# EAGLE design MaPIE RP2040 0.96‘‘ OLED V1.1 (EAGLE 6.1)
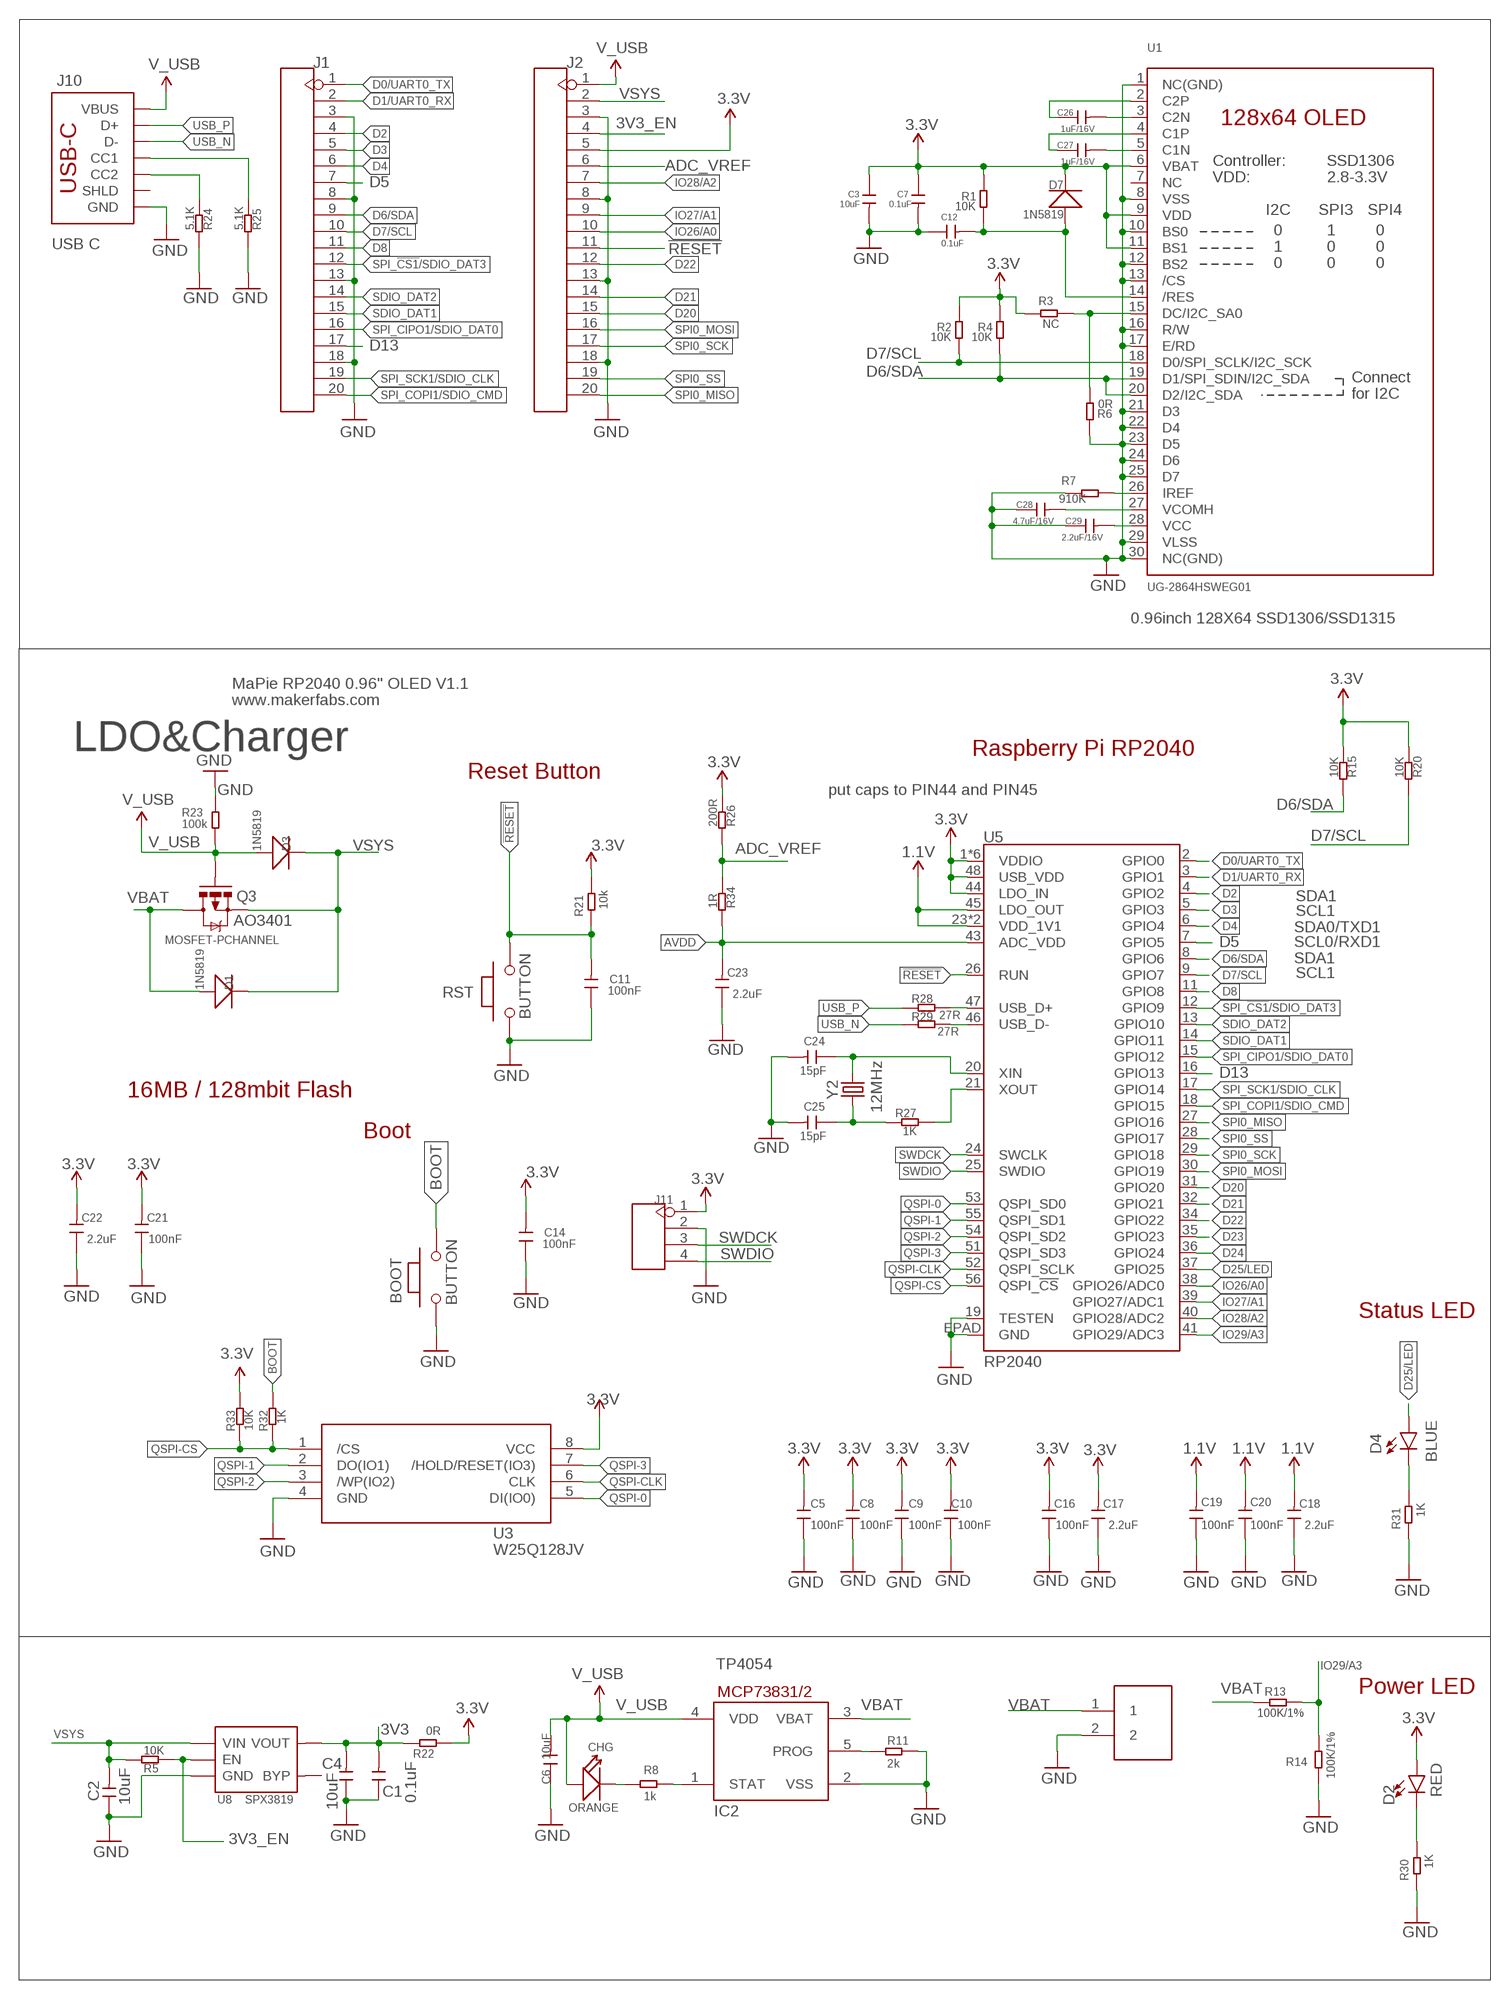
[diagram p0: schematic, sheet 1]

## Parts
BAT  PH2.0-2P-90-DIP  [PH2.0-2P-90-DIP]
BOOT  BUTTON  PB157  [157SW]
C1  0.1uF  C-0603  [C0603]
C2  10uF  C-0603  [C0603]
C3  10uF  C-0603  [C0603]
C4  10uF  C-0603  [C0603]
C5  100nF  C-0603  [C0603]
C6  10uF  C-0603  [C0603]
C7  0.1uF  C-0603  [C0603]
C8  100nF  C-0603  [C0603]
C9  100nF  C-0603  [C0603]
C10  100nF  C-0603  [C0603]
C11  100nF  C-0603  [C0603]
C12  0.1uF  C-0603  [C0603]
C14  100nF  C-0603  [C0603]
C16  100nF  C-0603  [C0603]
C17  2.2uF  C-0603  [C0603]
C18  2.2uF  C-0603  [C0603]
C19  100nF  C-0603  [C0603]
C20  100nF  C-0603  [C0603]
C21  100nF  C-0603  [C0603]
C22  2.2uF  C-0603  [C0603]
C23  2.2uF  C-0603  [C0603]
C24  15pF  C-0603  [C0603]
C25  15pF  C-0603  [C0603]
C26  1uF/16V  C-0603  [C0603]
C27  1uF/16V  C-0603  [C0603]
C28  4.7uF/16V  C-0603  [C0603]
C29  2.2uF/16V  C-0603  [C0603]
CHG  ORANGE  007-LED0603  [D0603]
D1  1N5819  D'0805'  [SOD323]
D2  RED  LED-RED0603  [LED-0603]
D3  1N5819  D'0805'  [SOD323]
D4  BLUE  LED-BLUE0603  [LED-0603]
D7  1N5819  D'0805'  [SOD323]
IC2  MCP73831/OT  [SOT23-5L]
J1  HEADER-20P-2.54  [20P-2.54]
J2  HEADER-20P-2.54  [20P-2.54]
J10  USB C  USB_C_4-LAYER-ISOLATED  [USB-C-16P-4LAYER-ISOLATED]
J11  HEADER-4P-60/35MILROUND  [4P-65/35ROUND]
Q3  MOSFET-PCHANNEL  [SOT23-3]
R1  10K  R-0603  [0603]
R2  10K  R-0603  [0603]
R3  NC  R-0603  [0603]
R4  10K  R-0603  [0603]
R5  10K  R-0603  [0603]
R6  0R  R-0603  [0603]
R7  910K  R-0603  [0603]
R8  1k  R-0603  [0603]
R11  2k  R-0603  [0603]
R13  100K/1%  R-0603  [0603]
R14  100K/1%  R-0603  [0603]
R15  10K  R-0603  [0603]
R20  10K  R-0603  [0603]
R21  10k  R-0603  [0603]
R22  0R  R-0603  [0603]
R23  100k  R-0603  [0603]
R24  5.1K  R-0603  [0603]
R25  5.1K  R-0603  [0603]
R26  200R  R-0603  [0603]
R27  1K  R-0603  [0603]
R28  27R  R-0603  [0603]
R29  27R  R-0603  [0603]
R30  1K  R-0603  [0603]
R31  1K  R-0603  [0603]
R32  1K  R-0603  [0603]
R33  10K  R-0603  [0603]
R34  1R  R-0603  [0603]
RST  BUTTON  PB157  [157SW]
U1  UG-2864HSWEG01  DISP_OLED_UG-2864HSWEG010.96"  [UG-2864HSWEG01_0.96IN_WRAPAROUND]
U3  W25Q128JV  [SOIC-8-208MIL]
U5  RP2040  [QFN-56]
U8  SPX3819  [SOT23-5]
Y2  12MHz  CRYSTAL-12MHZ  [CRYSTAL-SMD-2X2.5MM]

## Nets
1.1V: C18.2 C19.2 C20.2 U5.23(VDD_1V1) U5.45(LDO_OUT) U5.50(VDD_1V1)
3.3V: C3.1 C5.2 C7.1 C8.2 C9.2 C10.2 C14.2 C16.2 C17.2 C21.2 C22.2 D2.A D7.- J2.5 J11.1 R1.2 R2.2 R3.2 R4.2 R15.2 R20.2 R21.1 R22.1 R26.2 R33.1 U1.6(VBAT) U1.9(VDD) U1.11(BS1) U3.8(VCC) U5.1(VDDIO) U5.10(VDDIO) U5.22(VDDIO) U5.33(VDDIO) U5.42(VDDIO) U5.44(LDO_IN) U5.48(USB_VDD) U5.49(VDDIO)
3V3: C1.2 C4.2 R22.2 U8.5(VOUT)
3V3_EN: J2.4 R5.2 U8.3(EN)
!RESET!: C11.2 J2.11 R21.2 RST.2 U5.26(RUN)
ADC_VREF: J2.6 R26.1 R34.2
AVDD: C23.2 R34.1 U5.43(ADC_VDD)
BOOT: BOOT.2 R32.1
D0/UART0_TX: J1.1 U5.2(GPIO0)
D1/UART0_RX: J1.2 U5.3(GPIO1)
D2: J1.4 U5.4(GPIO2)
D3: J1.5 U5.5(GPIO3)
D4: J1.6 U5.6(GPIO4)
D5: J1.7 U5.7(GPIO5)
D6/SDA: J1.9 R4.1 R15.1 U1.19(D1/SPI_SDIN/I2C_SDA) U1.20(D2/I2C_SDA) U5.8(GPIO6)
D7/SCL: J1.10 R2.1 R20.1 U1.18(D0/SPI_SCLK/I2C_SCK) U5.9(GPIO7)
D8: J1.11 U5.11(GPIO8)
D13: J1.17 U5.16(GPIO13)
D20: J2.15 U5.31(GPIO20)
D21: J2.14 U5.32(GPIO21)
D22: J2.12 U5.34(GPIO22)
D23: U5.35(GPIO23)
D24: U5.36(GPIO24)
D25/LED: D4.A U5.37(GPIO25)
GND: BAT.2 BOOT.1 C1.1 C2.1 C3.2 C4.1 C5.1 C6.1 C7.2 C8.1 C9.1 C10.1 C11.1 C12.1 C14.1 C16.1 C17.1 C18.1 C19.1 C20.1 C21.1 C22.1 C23.1 C24.2 C25.2 C28.1 C29.1 IC2.2(VSS) J1.3 J1.8 J1.13 J1.18 J2.3 J2.8 J2.13 J2.18 J10.GND J10.GND2(GND) J11.2 R6.2 R7.2 R11.2 R14.1 R23.2 R24.1 R25.1 R30.2 R31.2 RST.1 U1.1(NC(GND)) U1.8(VSS) U1.10(BS0) U1.12(BS2) U1.13(/CS) U1.16(R/W) U1.17(E/RD) U1.21(D3) U1.22(D4) U1.23(D5) U1.24(D6) U1.25(D7) U1.29(VLSS) U1.30(NC(GND)) U3.4(GND) U5.19(TESTEN) U5.EPAD(GND) U8.2(GND)
IO26/A0: J2.10 U5.38(GPIO26/ADC0)
IO27/A1: J2.9 U5.39(GPIO27/ADC1)
IO28/A2: J2.7 U5.40(GPIO28/ADC2)
IO29/A3: R13.1 R14.2 U5.41(GPIO29/ADC3)
N$1: C24.1 U5.20(XIN) Y2.P3
N$2: D4.C R31.1
N$3: R3.1 R6.1 U1.15(DC/I2C_SA0)
N$4: R27.1 U5.21(XOUT)
N$5: C28.2 U1.27(VCOMH)
N$6: C25.1 R27.2 Y2.P1
N$7: D2.C R30.1
N$8: C29.2 U1.28(VCC)
N$9: R7.1 U1.26(IREF)
N$10: C26.2 U1.3(C2N)
N$11: J10.A5(CC1) R25.2
N$12: J10.B5(CC2) R24.2
N$13: C26.1 U1.2(C2P)
N$14: C27.1 U1.4(C1P)
N$15: C27.2 U1.5(C1N)
N$20: C12.2 D7.+ R1.1 U1.14(/RES)
N$25: CHG.- R8.1
N$26: IC2.1(STAT) R8.2
N$31: IC2.5(PROG) R11.1
QSPI-0: U3.5(DI(IO0)) U5.53(QSPI_SD0)
QSPI-1: U3.2(DO(IO1)) U5.55(QSPI_SD1)
QSPI-2: U3.3(/WP(IO2)) U5.54(QSPI_SD2)
QSPI-3: U3.7(/HOLD/RESET(IO3)) U5.51(QSPI_SD3)
QSPI-CLK [Clock]: U3.6(CLK) U5.52(QSPI_SCLK)
QSPI-CS: R32.2 R33.2 U3.1(/CS) U5.56(QSPI_!CS!)
SDIO_DAT1: J1.15 U5.14(GPIO11)
SDIO_DAT2: J1.14 U5.13(GPIO10)
SPI0_MISO: J2.20 U5.27(GPIO16)
SPI0_MOSI: J2.16 U5.30(GPIO19)
SPI0_SCK: J2.17 U5.29(GPIO18)
SPI0_SS: J2.19 U5.28(GPIO17)
SPI_!CS1!/SDIO_DAT3: J1.12 U5.12(GPIO9)
SPI_CIPO1/SDIO_DAT0: J1.16 U5.15(GPIO12)
SPI_COPI1/SDIO_CMD: J1.20 U5.18(GPIO15)
SPI_SCK1/SDIO_CLK: J1.19 U5.17(GPIO14)
SWDCK: J11.3 U5.24(SWCLK)
SWDIO: J11.4 U5.25(SWDIO)
USB_F_N: R29.1 U5.46(USB_D-)
USB_F_P: R28.1 U5.47(USB_D+)
USB_N: J10.A7(D-) J10.B7(D-) R29.2
USB_P: J10.A6(D+) J10.B6(D+) R28.2
V_USB: C6.2 CHG.+ D3.+ IC2.4(VDD) J2.1 J10.VBUS1(VBUS) J10.VBUS2(VBUS) Q3.1(G) R23.1
VBAT: BAT.1 D1.+ IC2.3(VBAT) Q3.3(D) R13.2
VSYS: C2.2 D1.- D3.- J2.2 Q3.2(S) R5.1 U8.1(VIN)
Unconnected: J10.SHLD1(SHLD) J10.SHLD2(SHLD) J10.SHLD3(SHLD) J10.SHLD4(SHLD) J10.SHLD5(SHLD) J10.SHLD6(SHLD) J10.SHLD7(SHLD) J10.SHLD8(SHLD) U1.7(NC) U8.4(BYP)

## Notes on the sheet
- 0.96inch 128X64 SSD1306/SSD1315
- MaPie RP2040 0.96" OLED V1.1
- www.makerfabs.com
- LDO&Charger | Raspberry Pi RP2040
- Reset Button
- put caps to PIN44 and PIN45
- SDA1
- SCL1
- AO3401
- SDA0/TXD1
- SCL0/RXD1
- SDA1
- SCL1
- 16MB / 128mbit Flash
- Boot
- Status LED
- TP4054
- Power LED

## Library data of the parts
BAT = Connector:PH2.0-2P-90-DIP
BOOT RST = MySMD:PB157
C1-C12 C14 C16-C29 = Discrete:C*: Ceramic Capacitors
CHG = Discrete:007-LED*
D1 D3 D7 = Discrete:D*
D2 = SparkFun-LED:LED-RED: Red SMD LED Used in manufacturing of most products at SparkFun Packages: 0603 - SMD 0603 package [Product Link] <http://docs.avagotech.com/docs/AV02-0551EN> 0603 SMART - SMD 0603 SMART package ( more efficient and expensive)[Product Link] <http://www.osram-os.com/Graphics/XPic2/00077099_0.pdf> 1206 - SMD1206 package [Product Link] <https://www.sparkfun.com/datasheets/DevTools/LilyPad/Q150OVS4.pdff> SparkFun Products: Pro Mini 328 -5V <https://www.sparkfun.com/products/821> RedBoard <https://www.sparkfun.com/products/12757> IOIO-OTG <https://www.sparkfun.com/products/13613>; PROD_ID: DIO-00819
D4 = SparkFun-LED:LED-BLUE: Blue SMD LED Used in manufacturing of various products at SparkFun Packages: 0603 - SMD 0603 package [Product Link] <http://www.digikey.com/product-detail/en/SMLE12BC7TT86/511-1589-2-ND/1641808> 1206 - SMD1206 package [Product Link] <http://www.digikey.com/product-detail/en/lite-on-inc/LTST-C150TBKT/160-1643-1-ND/573584> SparkFun Products: ESP8266 Thing-Dev Board <https://www.sparkfun.com/products/13711> RedBoard <https://www.sparkfun.com/products/12757>; PROD_ID: DIO-08575
IC2 = adafruit:MCP73831: MCP73831/2 Miniature Single-Cell, Fully Integrated Li-Ion, Li-Polymer Charge Management Controllers. Nice and small simple lipoly charge controller, with adjustable current and status output (LED) http://www.ladyada.net/library/pcb/eaglelibrary.html
J1 J2 = Connector:HEADER-20P
J10 = SparkFun-Connectors:USB_C: USB Type C 16Pin Connector Super Speed pins not available on the 16-pin purely SMD connector so this part is best for USB 2.0 implementations. D1 and D2 are tied together enabling D+/- no matter which way the cable is plugged into the connector. The two channel configuration pins (CC1/2) are exposed. These are normally connected to ground via 5.1k resistors but can be reconfigured for high current/high power applications. **4-LAYER BOARD WARNING!!** If designing 4-layer board, make sure to select the variant _4-LAYER-ISOLATED. The linked footprint (USB-C-16-4LAYER-ISOLATED) includes some very necessary cutout polygons in the inner layers (2 and 15). This prevents the PTH mounting shield legs on the USB connector from electrically connecting any other polygons on the inner layers (usually VCC and GND).; PROD_ID: CONN-14122; VALUE: USB Female Type C Connector
J11 = Connector:HEADER-4P
Q3 = User-Submitted:MOSFET-PCHANNEL: Generic PMOSFET IRLML2244 - TRANS-11153 (SOT-23 -20V -4.3A) (1.Gate 2.Source 3.Drain) FQP27P06 - COM-10349 <http://www.sparkfun.com/products/10349> (TO-220 -60V -27A) (1.Gate 2.Source 3.Drain); PROD_ID: TRANS-08285
R1-R8 R11 R13-R15 R20-R34 = Discrete:R*
U1 = adafruit_display:DISP_OLED_UG-2864HSWEG01: UG-2864HSWEG01 OLED display Both 1.3" and 0.96" models share the same FPC tab footprint, only the screen dimensions vary.
U3 = self:W25Q128JV
U5 = RP2040:RP2040: Raspberry Pi RP2040 MCU 56-pin 32-bit Microcontroller with 264kB of SRAM and external flash support up to 16MB Getting Started with the RP2040 <https://pico.raspberrypi.org/getting-started/> Dual-core ARM Cortex M0+ processor, flexible clock running up to 133 MHz 264kB of SRAM, and QSPI control of common flash memory USB 1.1 Host and Device support Low-power sleep and dormant modes Drag & drop programming using mass storage over USB 26 multi-function GPIO pins 2×SPI, 2×I2C, 2×UART, 3×12-bit ADC, 16×controllable PWM channels Accurate clock and timer on-chip Temperature sensor Accelerated floating point libraries on-chip 8×Programmable IO (PIO) state machines for custom peripheral support; PROD_ID: IC-15502
U8 = IC:SPX3819
Y2 = SparkFun-Clocks:CRYSTAL-12MHZ: 12.0MHz Crystal Frequency: 12.0MHz Frequency Tolerance: ±20ppm Load Capacitance: 18pF SparkFun Products: SparkFun Logomatic <https://www.sparkfun.com/products/12772> Pocket AVR Programmer <https://www.sparkfun.com/products/9825>; PROD_ID: XTAL-15540

## Net classes
0 default: width 0.203 mm, drill 0.305 mm, clearance 0.152 mm
2 Clock: width 0.089 mm, clearance 0.178 mm

## Board
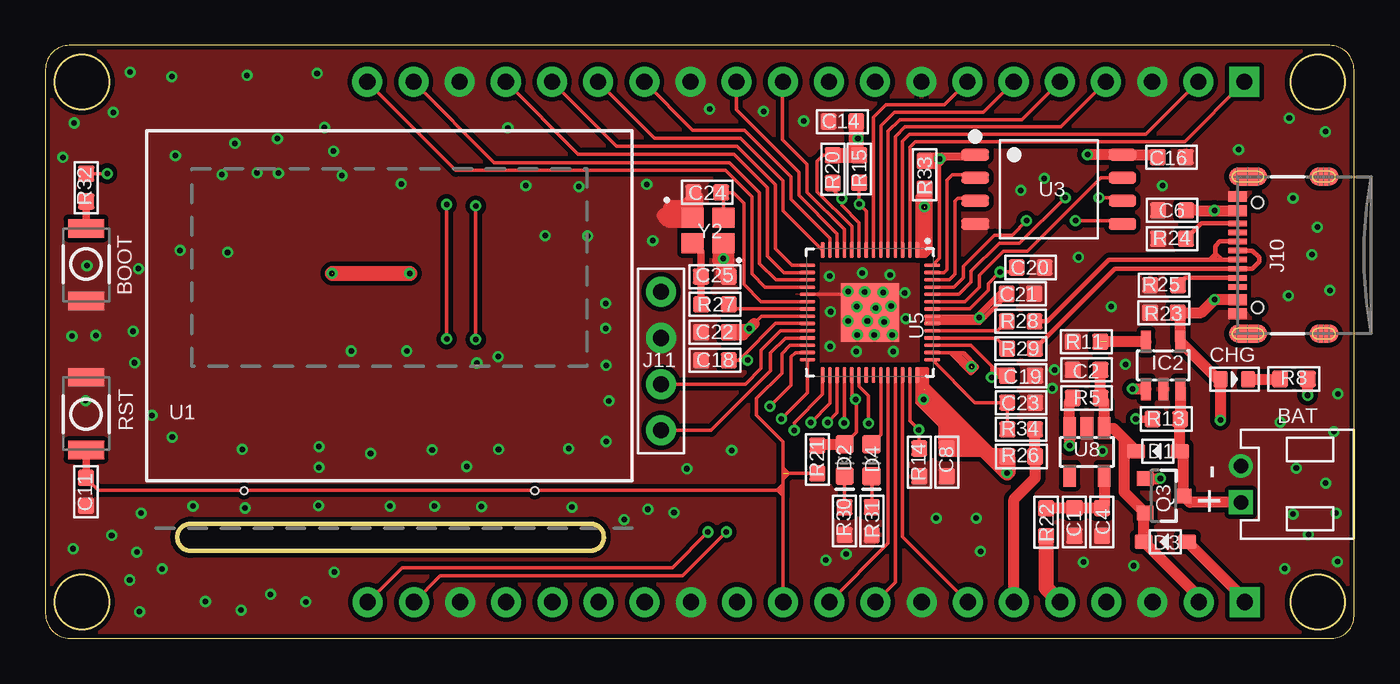
[diagram p1: board, top side]
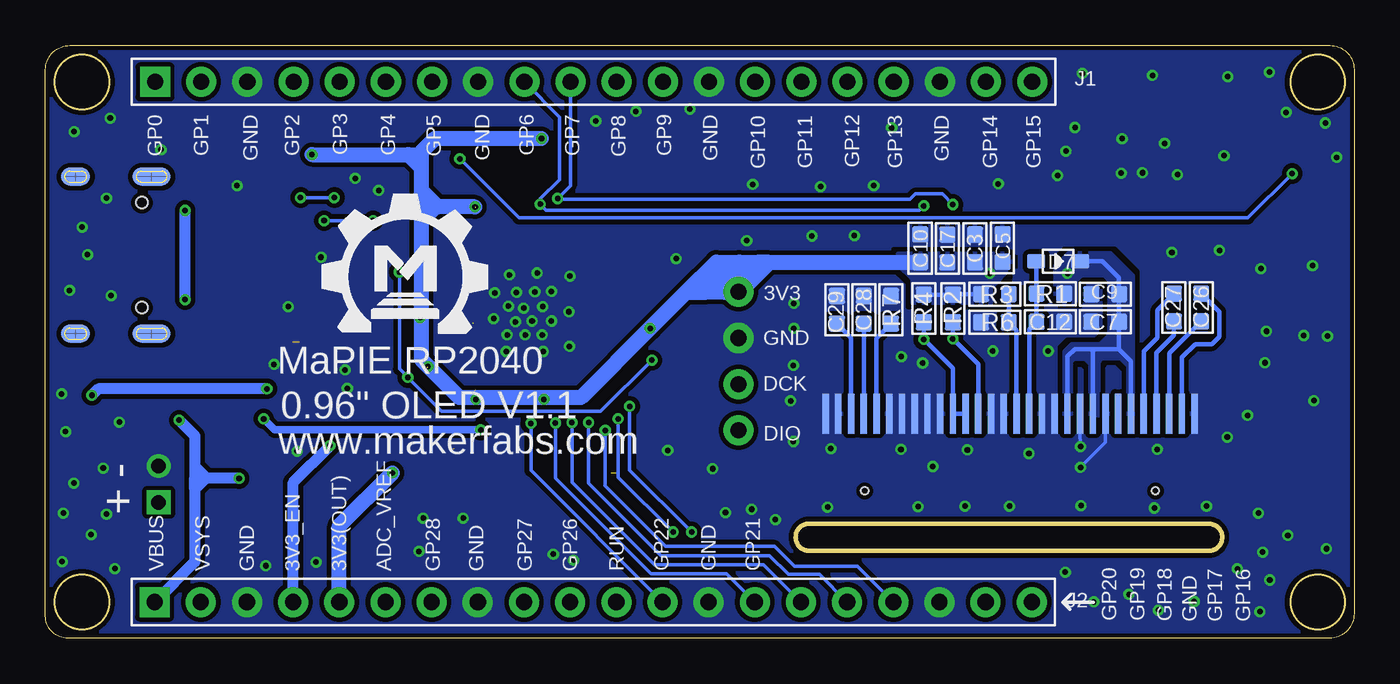
[diagram p2: board, bottom side, seen from below]

Size 72 x 32.6 mm. Coordinates in mm from the lower left corner, seen from the top.
Outline: 8,6.3 8.03,6.3
Outline: 8.03,6.3 30,6.3
Outline: 30,4.8 8,4.8
Outline: 8,4.8 8,4.8
Outline: 8,4.8 arc-182 8.03,6.3
Outline: 29.97,6.3 arc-182 29.95,4.8
Outline: 1.35,0 70.78,0 arc90 72,1.22 72,31.26 arc90 70.66,32.6 1.32,32.6 arc90 0,31.28 0,1.35 arc90 1.35,0
Outline: circle at 2,2 radius 1.5
Outline: circle at 2,30.6 radius 1.5
Outline: circle at 70,30.6 radius 1.5
Outline: circle at 70,2 radius 1.5
Copper layers (1*16): Top 0.035mm / dielectric 1.5mm / Bottom 0.035mm
Design rules: minimum track width 8mil, minimum drill 8mil, track to track 6mil, track to pad 6mil, pad to pad 6mil, via to via 6mil, smd to smd 0mil, copper to edge 8mil, drill to drill 8mil, minimum pad ring 10mil, minimum via ring 6mil, stop-mask expansion 4mil, vias tented up to drill 100mil, thermal gap 0mil

### Footprints (pad centres in the part's own frame; a part is rotated, then mirrored left to right if it is on the bottom)
PH2.0-2P-90-DIP = drill 0.8 square: 1 0,1 | drill 0.8: 2 0,-1
157SW = smd 1.016 x 1.981: 1 0,0; 2 4,0
C0603 = smd 0.889 x 0.889: 1 -0.762,0; 2 0.762,0
D0603 = smd 0.762 x 0.889: + -0.762,0; - 0.762,0
SOD323 = smd 1 x 0.8: + -1.2,0; - 1.2,0
LED-0603 = smd 1 x 1: A -0.877,0; C 0.877,0
SOT23-5L = smd 0.55 x 1.2: 1 -0.95,-1.3; 2 0,-1.3; 3 0.95,-1.3; 4 0.95,1.3; 5 -0.95,1.3
20P-2.54 = drill 0.889 pad 1.651 square: 1 -25.4,0 | drill 0.889 pad 1.651: 2 -22.86,0; 3 -20.32,0; 4 -17.78,0; 5 -15.24,0; 6 -12.7,0; 7 -10.16,0; 8 -7.62,0; 9 -5.08,0; 10 -2.54,0; 11 0,0; 12 2.54,0; 13 5.08,0; 14 7.62,0; 15 10.16,0; 16 12.7,0; 17 15.24,0; 18 17.78,0; 19 20.32,0; 20 22.86,0
USB-C-16P-4LAYER-ISOLATED = smd 0.3 x 1: A5 -1.25,-0.34; A6 -0.25,-0.34; A7 0.25,-0.34; A8 1.25,-0.34; B5 1.75,-0.34; B6 0.75,-0.34; B7 -0.75,-0.34; B8 -1.75,-0.34 | smd 0.6 x 1: GND -3.225,-0.34; GND2 3.225,-0.34; VBUS1 -2.45,-0.34; VBUS2 2.45,-0.34 | smd 1 x 2.1: SHLD1 -4.32,-0.915; SHLD2 4.32,-0.915 | smd 1 x 2.1 bottom: SHLD3 -4.32,-0.915; SHLD4 4.32,-0.915 | smd 1 x 1.6: SHLD5 -4.32,-5.095; SHLD8 4.32,-5.095 | smd 1 x 1.6 bottom: SHLD6 -4.32,-5.095; SHLD7 4.32,-5.095 | hole 0.65: -2.89,-1.445; 2.89,-1.445
4P-65/35ROUND = drill 0.889 pad 1.651: 1 0,3.81; 2 0,1.27; 3 0,-1.27; 4 0,-3.81
SOT23-3 = smd 0.8 x 0.9: 1 -0.95,-1; 2 0.95,-1; 3 0,1.1
0603 = smd 0.889 x 0.889: 1 -0.762,0; 2 0.762,0
UG-2864HSWEG01_0.96IN_WRAPAROUND = smd 0.35 x 2.2 bottom: 1 -10.15,-1.2; 2 -9.45,-1.2; 3 -8.75,-1.2; 4 -8.05,-1.2; 5 -7.35,-1.2; 6 -6.65,-1.2; 7 -5.95,-1.2; 8 -5.25,-1.2; 9 -4.55,-1.2; 10 -3.85,-1.2; 11 -3.15,-1.2; 12 -2.45,-1.2; 13 -1.75,-1.2; 14 -1.05,-1.2; 15 -0.35,-1.2; 16 0.35,-1.2; 17 1.05,-1.2; 18 1.75,-1.2; 19 2.45,-1.2; 20 3.15,-1.2; 21 3.85,-1.2; 22 4.55,-1.2; 23 5.25,-1.2; 24 5.95,-1.2; 25 6.65,-1.2; 26 7.35,-1.2; 27 8.05,-1.2; 28 8.75,-1.2; 29 9.45,-1.2; 30 10.15,-1.2 | hole 0.4: -8,-5.45; 8,-5.45
SOIC-8-208MIL = smd 1.5 x 0.635: 1 -4.05,1.905; 2 -4.05,0.635; 3 -4.05,-0.635; 4 -4.05,-1.905; 5 4.05,-1.905; 6 4.05,-0.635; 7 4.05,0.635; 8 4.05,1.905
QFN-56 = smd 0.875 x 0.2: 1 -3.437,2.6; 2 -3.437,2.2; 3 -3.437,1.8; 4 -3.437,1.4; 5 -3.437,1; 6 -3.437,0.6; 7 -3.437,0.2; 8 -3.437,-0.2; 9 -3.437,-0.6; 10 -3.437,-1; 11 -3.437,-1.4; 12 -3.437,-1.8; 13 -3.437,-2.2; 14 -3.437,-2.6; 29 3.437,-2.6; 30 3.437,-2.2; 31 3.437,-1.8; 32 3.437,-1.4; 33 3.437,-1; 34 3.437,-0.6; 35 3.437,-0.2; 36 3.437,0.2; 37 3.437,0.6; 38 3.437,1; 39 3.437,1.4; 40 3.437,1.8; 41 3.437,2.2; 42 3.437,2.6 | smd 0.2 x 0.875: 15 -2.6,-3.437; 16 -2.2,-3.437; 17 -1.8,-3.437; 18 -1.4,-3.437; 19 -1,-3.437; 20 -0.6,-3.437; 21 -0.2,-3.437; 22 0.2,-3.437; 23 0.6,-3.437; 24 1,-3.437; 25 1.4,-3.437; 26 1.8,-3.437; 27 2.2,-3.437; 28 2.6,-3.437; 43 2.6,3.437; 44 2.2,3.437; 45 1.8,3.437; 46 1.4,3.437; 47 1,3.437; 48 0.6,3.437; 49 0.2,3.437; 50 -0.2,3.437; 51 -0.6,3.437; 52 -1,3.437; 53 -1.4,3.437; 54 -1.8,3.437; 55 -2.2,3.437; 56 -2.6,3.437 | smd 3.2 x 3.2: EPAD 0,0
SOT23-5 = smd 0.69 x 1.2: 1 -0.95,-1.3; 2 0,-1.3; 3 0.95,-1.3; 4 0.95,1.3; 5 -0.95,1.3
CRYSTAL-SMD-2X2.5MM = smd 1.2 x 1.1: P1 0.846,0.69; P2 -0.854,0.69; P3 -0.854,-0.71; P4 0.846,-0.71

### Placement (x,y rotation side)
BAT  65.77,8.47 180 top
BOOT  2.24,18.54 90 top
C1  56.61,6.39 90 top
C2  57.28,14.76 0 top
C3  20.85,21.44 90 bottom
C4  58.13,6.39 90 top
C5  19.34,21.46 270 bottom
C6  61.99,23.53 0 top
C7  13.69,17.4 180 bottom
C8  49.59,9.67 90 top
C9  13.69,18.93 0 bottom
C10  23.87,21.45 270 bottom
C11  2.23,8.05 90 top
C12  16.71,17.4 180 bottom
C14  43.85,28.41 0 top
C16  61.96,26.46 180 top
C17  22.38,21.43 270 bottom
C18  36.84,15.28 0 top
C19  53.67,14.43 180 top
C20  54.21,20.39 180 top
C21  53.64,18.94 180 top
C22  36.84,16.82 0 top
C23  53.68,12.96 180 top
C24  36.41,24.52 180 top
C25  36.83,19.89 0 top
C26  8.41,18.19 270 bottom
C27  9.91,18.19 90 bottom
C28  26.97,18.06 270 bottom
C29  28.45,18.06 270 bottom
CHG  65.41,14.24 0 top
D1  61.21,10.29 180 top
D2  43.97,9.79 270 top
D3  61.62,5.31 180 top
D4  45.44,9.78 270 top
D7  16.28,20.73 0 bottom
IC2  61.5,15 0 top
J1  40.57,30.6 0 bottom
J2  40.59,1.99 0 bottom
J10  65.25,21.07 90 top
J11  33.86,15.24 0 top
Q3  61.51,7.83 270 top
R1  16.71,18.95 0 bottom
R2  22.07,18.14 90 bottom
R3  19.76,18.92 180 bottom
R4  23.67,18.14 90 bottom
R5  57.29,13.21 180 top
R6  19.76,17.37 180 bottom
R7  25.48,18.06 90 bottom
R8  68.69,14.25 0 top
R11  57.27,16.31 180 top
R13  61.67,12.05 0 top
R14  48.08,9.67 90 top
R15  44.77,25.8 90 top
R20  43.32,25.8 90 top
R21  42.47,9.83 270 top
R22  55.06,6.37 90 top
R23  61.54,17.9 180 top
R24  61.99,21.97 0 top
R25  61.55,19.42 0 top
R26  53.69,9.99 180 top
R27  36.84,18.36 180 top
R28  53.66,17.42 0 top
R29  53.67,15.92 0 top
R30  43.97,6.44 270 top
R31  45.47,6.44 270 top
R32  2.25,24.78 90 top
R33  48.37,25.49 90 top
R34  53.69,11.48 0 top
RST  2.24,14.35 270 top
U1  18.92,13.55 0 top
U3  55.2,24.69 0 top
U5  45.36,17.91 270 top
U8  57.3,10.24 180 top
U$1  [MAKERFABS_0.3]  56.32,16.82 0 bottom
Y2  36.45,22.41 180 top

### Tracks (layer width: path | path; a pad name or v marks a point on that pad's centre or on a via)
1.1V  (via drill 0.3)
  Top 0.203: U5.23 40.17,17.31 38.38,15.52 | 38.38,15.52 38.14,15.28 C18.2 | U5.50 50.88,18.11 51.89,19.13 51.89,19.51 v52.53,20.14 53.2,20.14 C20.2 | U5.45 50.92,16.11 52.06,14.97 | v38.63,15.29 38.61,15.29 38.38,15.52 | 52.06,14.97 v52.06,14.34 52.82,14.34 C19.2 | 52.06,14.97 52.25,14.78 53.24,14.78 53.11,14.66 52.15,14.66 52.32,14.48 | 52.32,14.48 52.55,14.48 | 52.32,14.48 52.12,14.48
  Bottom 0.203: v38.63,15.29 41.45,12.47 50.19,12.47 v52.06,14.34 52.53,14.81 v52.53,20.14
3.3V  (via drill 0.3)  (6 unrouted)
  Top 0.203: U5.49 U5.48 | U5.49 49.78,17.71 | U5.33 44.36,13.35 v44.58,13.13 44.63,13.08 44.63,11.32 D2.A | U5.22 39.4,17.71 38.99,17.3 v38.73,17.04 | v38.73,17.04 38.05,17.04 | U5.49 51.16,17.71 | 51.16,17.71 52.38,18.92 | 52.38,18.92 52.39,18.94 | 52.39,18.94 C21.2 | U5.42 47.96,13.13 | 47.96,13.13 47.96,12.95 49.58,11.33 C8.2 | U5.10 44.36,22.64 42.44,24.56 42.44,26.24 42.77,26.57 R20.2 | U5.1 47.96,24.31 R33.1 | C14.2 44.73,28.3 | U5.44 50.18,15.71 v50.95,14.94 | v48.31,13.13 47.96,13.13 | C22.2 38.52,16.82 v38.73,17.04 | 51.16,17.71 51.3,17.71 v51.38,17.63 | 47.98,21.01 48.44,21.01 48.72,21.29 48.72,24.69 48.36,24.33 48.36,23.67 | 50.77,17.7 51.05,17.42 51.51,17.42 | 51.51,17.42 52.65,18.57 53.24,18.57 53.24,19.28 51.51,17.55 51.03,17.55 51.1,17.63 51.33,17.63 52.53,18.82 52.48,18.82 52.38,18.92 | 52.39,18.94 52.5,19.05 52.96,19.05 | 48.46,17.32 51.41,17.32 51.51,17.42 | 48.31,13.66 48.54,13.89 48.54,14.81 47.98,14.81 | 48.08,14.68 48.08,13.99 48.23,13.99 48.23,14.68 48.39,14.68 48.39,13.64 48.11,13.36 48.11,13.01 49.71,11.4 49.71,10.87 50.47,10.87 | 50.55,10.87 50.47,10.87 | 50.47,10.87 48.28,13.06 48.28,12.85 50.14,11 49.91,11 49.76,11.15 | v44.7,27.48 44.65,27.41 44.61,27.41
  Top 0.254: 51.56,17.53 48.51,17.53 48.49,17.55 | 48.49,17.55 48.49,17.68 | 48.49,17.55 48.49,17.35 | 50.9,14.61 49.84,15.67 50.52,15.67 51.26,14.94 51.26,14.91 50.93,14.58 50.93,14.81 51,14.88 50.83,14.88 50.16,15.54
  Top 0.61: R26.2 52.93,9.97 | C16.2 61.06,26.59 U3.8 v57.33,26.59 | v48.36,23.72 R33.1 | 48.36,23.67 48.34,23.65 48.34,21.21 | R21.1 42.55,10.67 D2.A | 37.57,16.69 38.38,16.69 38.66,16.97 | 38.99,17.3 38.66,16.97 | 38.66,16.97 37.47,16.97
  Top 0.813: R22.1 55.06,2.76 J2.5 | C8.2 51.56,10.44 | 51.56,10.44 51.61,10.39 | 51.61,10.39 51.97,10.03 | 51.97,10.03 52.23,9.77 | 52.23,9.77 v52.91,9.09 52.96,9.14 52.96,9.86 | 52.93,9.97 52.72,9.77 52.23,9.77 | 51.56,10.44 48.34,13.66 48.31,13.66 | 49.58,10.39 51.61,10.39 | 52.88,10.03 51.97,10.03 | 49.55,10.41 49.55,11.86 | 15.8,20.07 v20.04,20.07 | R20.2 R15.2 44.61,26.72 44.61,27.41 C14.2
  Bottom 0.203: v48.31,13.13 48.9,13.13 49,13.23 | 42.55,13.23 44.48,13.23 v44.58,13.13 | v51.38,17.63 51.33,17.63 51.31,17.6
  Bottom 0.254: U1.6 12.27,15.24 12.93,15.9 | 12.93,15.9 14.3,15.9 | 14.3,15.9 15.37,15.9 15.77,15.49 15.77,13.36 U1.11 | U1.9 14.37,15.83 14.3,15.9 | 12.93,15.9 C7.1 C9.2 12.93,19.81 13.84,20.73 D7.- | R3.2 22.05,18.92 R2.2 R4.2
  Bottom 0.61: v50.95,14.94 50.95,14.96 51,15.01
  Bottom 0.813: 51.31,22.96 51.31,17.6 51.31,15.32 51,15.01 49.23,13.23 49,13.23 42.55,13.23 v38.73,17.04 36.75,19.02 | 51.31,23.82 51.31,24.61 | 51.31,24.61 51.31,25.88 | 51.31,25.88 51.31,26.67 | 51.31,26.67 51.31,26.75 50.57,27.48 v44.7,27.48 | v48.36,23.72 50.42,23.72 | 50.42,23.72 50.55,23.72 | 50.55,23.72 51.21,23.72 51.31,23.82 | v57.33,26.59 52.02,26.59 | 52.02,26.59 51.38,26.59 51.31,26.67 | J2.5 55.83,6.17 v52.91,9.09 | 50.55,23.72 51.31,22.96 | 51.31,22.96 51.31,23.82 | 51.31,24.61 50.42,23.72 | 52.02,26.59 51.31,25.88 | 33.83,20.69 35.09,20.69 36.75,19.02 | 33.83,20.69 C10.2 | J11.1 33.87,20.66 33.83,20.69 | 34.59,19.02 33.81,19.02 32.16,20.68 32.84,20.68 33.86,19.66 | 34.59,19.02 35.74,19.02 | 36.75,19.02 35.74,19.02 | 35.74,19.02 34.59,20.17 34.59,19.02
  other vias: 15.77,20.07
  pour Bottom: 16.43,18.52 16.43,20.45 15.7,21.18 13.41,21.18 12.17,19.94 12.17,12.27 12.42,12.27 12.42,14.99 12.83,15.39 13.87,15.39 14.07,15.19 14.07,12.24 14.5,12.24 14.5,15.09 14.78,15.37 15.42,15.37 15.57,15.21 15.57,12.29 15.93,12.29 15.93,15.75 15.52,16.15 13.97,16.15 13.46,16.66 13.46,19.68 13.74,19.96 15.01,19.96 15.32,19.66 15.32,18.52
  pour Bottom: 19.99,18.44 24.31,18.44 24.31,19.76 25.1,20.55 25.1,21.13 18.87,21.13 18.87,20.4 19.96,19.3 19.99,19.28
3V3
  Top 0.61: U8.5 58.25,7.27 C4.2 C1.2 55.08,7.16 R22.2
3V3_EN  (via drill 0.3)
  Top 0.61: v56.35,10.59 U8.3 56.35,13.03 R5.2
  Bottom 0.61: J2.4 58.37,8.57 v56.35,10.59
!RESET!  (1 unrouted)
  Top 0.203: U5.26 40.98,16.11 40.51,15.65 40.51,14.58 39.12,13.18 39.12,12.27 40.59,10.79 40.59,9.04 | J2.11 40.59,8.13 | 40.59,8.13 40.59,9.04 | R21.2 40.61,9.06 40.59,9.04 | C11.2 2.92,8.13 40.28,8.13 | 40.28,8.13 40.59,8.13 | 40.28,8.13 40.59,7.82 40.59,8.46 | 40.59,8.48 40.59,8.46 | 40.59,8.46 40.28,8.15 | 40.59,9.37 40.89,9.07 40.89,9.04 40.62,8.76
  Top 0.406: C11.2 RST.2
ADC_VREF
  Top 0.61: J2.6 53.29,7.65 54.46,8.81 R26.1 R34.2
AVDD
  Top 0.203: U5.43 51.15,12.96 C23.2 R34.1
BOOT
  Top 0.406: BOOT.2 2.23,24.01 R32.1
D0/UART0_TX
  Top 0.203: U5.2 47.56,27.01 47.85,27.3 62.67,27.3 J1.1
D1/UART0_RX
  Top 0.203: U5.3 47.16,27.32 47.55,27.71 60.54,27.71 J1.2
D2
  Top 0.203: U5.4 46.76,27.59 47.3,28.12 55.87,28.12 J1.4
D3
  Top 0.203: U5.5 46.36,27.87 47.02,28.52 53.73,28.52 J1.5
D4
  Top 0.203: U5.6 45.96,28.18 46.71,28.93 51.6,28.93 J1.6
D5
  Top 0.203: U5.7 45.56,28.64 46.25,29.34 49.47,29.34 J1.7
D6/SDA  (via drill 0.3)
  Top 0.203: U5.8 45.16,23.49 v44.78,23.88 v44.77,23.89 R15.1 | v23.67,23.77 v23.67,16.43
  Bottom 0.203: J1.9 43.71,28.66 43.71,25.22 44.78,24.16 v44.78,23.88 44.45,23.55 23.9,23.55 v23.67,23.77
  Bottom 0.254: U1.19 U1.20 22.07,14.83 v23.67,16.43 R4.1
D7/SCL  (via drill 0.3)
  Top 0.203: U5.9 44.76,22.85 43.81,23.8 v43.81,24.18 43.32,24.68 R20.1 | v22.07,23.85 v22.07,16.46
  Bottom 0.203: J1.10 43.11,24.89 v43.81,24.18 43.76,24.13 24.43,24.13 24.13,24.43 22.66,24.43 v22.07,23.85
  Bottom 0.254: U1.18 20.67,15.06 v22.07,16.46 R2.1
D8
  Top 0.203: U5.11 43.96,22.48 41.91,24.54 41.91,26.06 40.56,27.41 J1.11
D13
  Top 0.203: U5.16 40.62,20.11 39.73,21.01 39.73,24.77 37.87,26.62 29.31,26.62 J1.17
D20  (via drill 0.3)
  Top 0.203: U5.31 43.56,12.4 v43.03,11.86
  Bottom 0.203: J2.15 32.48,4.04 38.48,4.04 43.03,8.59 v43.03,11.86
D21  (via drill 0.3)
  Top 0.203: U5.32 43.96,11.86 v43.94,11.84
  Bottom 0.203: J2.14 34.52,3.53 38.68,3.53 43.94,8.79 v43.94,11.84
D22  (via drill 0.3)
  Top 0.203: U5.34 44.76,13.86 45.29,13.34 v45.29,11.81
  Bottom 0.203: J2.12 45.29,9.22 v45.29,11.81
D25/LED
  Top 0.203: U5.37 45.96,11.18 D4.A
GND  (via drill 0.3)
  Top 0.203: U5.19 44,18.91 v44.16,19.07
  Top 0.813: 37.29,20.09 37.49,20.3 37.49,21.77 37.13,21.77 37.11,21.74 37.11,20.78 | 34.04,23.24 34.29,22.99 35.79,22.99 35.79,24.26 35.2,23.67 34.42,23.67
  Bottom 0.203: U1.8 13.67,10.77 v15.05,9.39 | U1.10 15.07,11.37 v15.05,10.54
  other vias: 69.68,21.1 70.44,8.53 33.14,7.09 71.11,13.43 5.03,4.74 71.02,6.88 68.82,9.35 28.79,10.43 0.96,26.45 2.21,13.07 15.85,26.79 17.89,10.16 5.12,20.32 2.77,16.65 3.65,5.66 68.39,18.84 68.18,3.82 69.48,5.69 70.89,11.36 68.64,6.82 71.08,4.21 14.32,2 6.97,11.05 6.42,3.81 4.9,15.15 10.42,27.21 4.64,3.2 67.93,11.88 8.8,2.02 10.03,21.22 5.27,6.88 5.86,12.25 1.52,4.92 1.46,16.61 4.66,31.14 23.18,9.44 9.72,25.5 12.76,27.48 12.82,25.57 16.32,25.45 15.36,28.09 12.38,2.41 10.99,7.16 11.65,25.6 70.42,27.86 68.44,28.6 70.67,19.13 69.99,22.61 68.64,24.21 5.18,1.46 4.83,16.88 3.73,28.92 2.29,20.49 45.07,19.05 46.09,19.02 47.28,19 47.33,17.57 46.52,18.26 45.68,18.16 44.64,18.23 44.16,17.45 45.23,17.45 46.14,17.39 46.6,16.68 45.61,16.68 44.67,16.68 46.47,19.99 44.95,20.09 43.14,19.91 43.19,17.95 43.17,16.05 44.62,15.77 46.65,15.77 53.66,24.63 54.95,25.29 56.83,20.95 61.46,24.89 65.65,26.87 58.64,18.23 55.51,14.75 59.42,15.06 57.11,4.19 59.88,3.98 37.76,10.33 30.82,18.41 30.85,15.01 16.83,15.79 19.88,15.79 24.91,15.49 7.41,21.33 10.83,10.38 24.93,10.38 6.95,30.88 11.09,30.96 14.95,31.06 7.15,26.54 19.57,24.99 33.08,24.96 29.35,24.84 26.43,24.89 33.41,21.87 29.83,22.12 27.5,22.14 37.3,20.87 41.72,28.44 39.51,28.98 36.54,29.1 25.44,28.06 23.74,15.13 30.82,17.04 30.85,10.82 31,13.05 58.15,10.28 55.39,13.74 49.01,6.6 51.22,6.6 51.45,4.77 42.94,4.29 44.06,4.62 34.58,6.9 35.29,9.32 18.96,7.26 23.99,7.23 28.97,7.21 31.84,6.52 21.27,10.36 15.03,7.29 8.12,7.26 21.4,7.26 15.89,3.63 10.76,1.55 1.57,28.34
  pour Top (isolate 0.254, rank 6): -8.51,37.36 75.44,37.36 75.44,-3.17 -8.52,-3.17 -8.52,37.36
  pour Bottom (isolate 0.254, rank 6): -2.54,35.56 76.2,35.56 76.2,-2.54 -2.54,-2.54
IO26/A0
  Top 0.203: U5.38 46.36,5.22 J2.10
IO27/A1
  Top 0.203: U5.39 46.76,3.08 J2.9
IO28/A2
  Top 0.203: U5.40 47.16,5.58 J2.7
IO29/A3  (via drill 0.3)
  Top 0.203: U5.41 47.56,11.95 v48.06,11.46 48.06,10.46 R14.2
  Top 0.406: R13.1 60.01,12.05 v59.99,12.06
  Bottom 0.406: v48.06,11.46 59.38,11.46 v59.99,12.06
N$1
  Top 0.203: U5.20 39.38,18.51 38.43,19.46 38.43,23.93 37.85,24.51 C24.1 37.31,24.39 Y2.P3
N$2
  Top 0.203: R31.1 45.47,8.88 D4.C
N$3
  Bottom 0.254: U1.15 18.57,16.95 R6.1 R3.1
N$4
  Top 0.203: U5.21 37.85,18.11 R27.1
N$5
  Bottom 0.254: U1.27 C28.2
N$6
  Top 0.406: R27.2 C25.1 36.07,21.26 Y2.P1
N$7
  Top 0.203: R30.1 D2.C
N$8
  Bottom 0.254: U1.28 27.67,16.52 C29.2
N$9
  Bottom 0.254: U1.26 26.27,16.5 R7.1
N$10
  Bottom 0.254: U1.3 10.17,15.66 C26.2
N$11
  Top 0.254: J10.A5 62.71,19.82 R25.2
N$12
  Top 0.254: J10.B5 63.6,22.82 R24.2
N$13
  Bottom 0.254: U1.2 9.47,15.44 8.74,16.18 7.82,16.18 7.42,16.59 7.42,17.96 C26.1
N$14
  Bottom 0.254: U1.4 10.87,15.7 9.91,16.66 C27.1
N$15
  Bottom 0.254: U1.5 11.57,15.78 10.82,16.54 10.82,18.03 C27.2
N$20
  Bottom 0.254: U1.14 17.87,17 C12.2 R1.1 D7.+
N$25
  Top 0.61: CHG.- 67.91,14.24 R8.1
N$26  (via drill 0.3)
  Top 0.61: IC2.1 59.83,13.7 v59.82,13.72 | v69.44,13.36 R8.2
  Bottom 0.61: v59.82,13.72 69.09,13.72 v69.44,13.36
N$31  (1 unrouted)
  Top 0.61: IC2.5 58.4,16.3
QSPI-0  (via drill 0.3)
  Top 0.203: U5.53 49.99,19.31 50.49,19.81 50.49,20.45 52.22,22.17 53.19,22.17 v53.98,22.96 | v56.67,22.96 59.08,22.96 U3.5
  Bottom 0.203: v53.98,22.96 v56.67,22.96
QSPI-1
  Top 0.203: U5.55 49.45,20.11 49.61,20.27 49.61,25.2 49.91,25.5 51.15,25.5 U3.2
QSPI-2
  Top 0.203: U5.54 49.73,19.71 50.04,20.02 50.04,24.03 50.22,24.21 51.13,24.21 U3.3
QSPI-3
  Top 0.203: U5.51 50.59,18.51 51.38,19.3 51.38,19.96 52.7,21.29 54.03,21.29 58.06,25.32 U3.7
QSPI-CLK  (via drill 0.3)
  Top 0.203: U5.52 50.25,18.91 50.93,19.58 50.93,20.17 52.48,21.72 53.59,21.72 v56.11,24.23 | v57.96,24.23 59.08,24.23 U3.6
  Bottom 0.203: v56.11,24.23 v57.96,24.23
QSPI-CS  (via drill 0.3)
  Top 0.203: 50.66,26.58 U3.1 | U5.56 49.17,20.89 49.17,25.68 | 49.17,25.88 49.17,25.98 | 49.17,25.98 49.17,26.53 | R32.2 v3.39,25.54 v3.4,25.55 | 49.17,25.98 49.55,26.36 50.6,26.36 50.67,26.44 49.43,26.44 49.2,26.21 48.69,26.21 48.49,26.01 48.49,25.91 48.95,25.91 49.17,25.68 | 49.17,25.68 49.17,25.88 | 49.17,25.88 48.97,26.09 48.77,26.09
  Top 0.254: 50.66,26.58 48.7,26.58 R33.2 48.49,26.36 v49.2,26.36 49.2,26.5 49.17,26.53
  Bottom 0.203: v49.2,26.36 45.95,23.11 5.84,23.11 v3.4,25.55
SDIO_DAT1
  Top 0.203: J1.15 33.5,27.51 38.25,27.51 40.59,25.17 40.59,23.52 U5.14
SDIO_DAT2
  Top 0.203: U5.13 43.16,21.99 41.02,24.13 41.02,25.38 38.46,27.94 35.61,27.94 J1.14
SPI0_MISO  (via drill 0.3)
  Top 0.203: U5.27 41.26,15.71 41.02,15.47 41.02,13.92 v39.85,12.75 | J2.20 19.63,3.89 34.49,3.89 v36.45,5.84
  Bottom 0.203: v36.45,5.84 39.85,9.25 v39.85,12.75
SPI0_MOSI  (via drill 0.3)
  Top 0.203: U5.30 43.16,12.91 v42.11,11.86
  Bottom 0.203: J2.16 29.41,3.5 31.11,3.5 32.16,4.55 38.12,4.55 42.11,8.53 v42.11,11.86
SPI0_SCK  (via drill 0.3)
  Top 0.203: U5.29 42.76,13.43 41.2,11.86 v41.2,11.43
  Bottom 0.203: J2.17 27.33,3.96 30.79,3.96 31.88,5.05 37.87,5.05 41.2,8.38 v41.2,11.43
SPI0_SS  (via drill 0.3)
  Top 0.203: U5.28 41.92,13.5 v40.49,12.06 | J2.19 21.71,3.43 35.05,3.43 v37.47,5.84
  Bottom 0.203: v37.47,5.84 40.49,8.87 40.49,12.01 v40.49,12.06
SPI_!CS1!/SDIO_DAT3
  Top 0.203: U5.12 43.56,22.25 41.45,24.36 41.45,25.63 38.02,29.06 J1.12
SPI_CIPO1/SDIO_DAT0
  Top 0.203: U5.15 41.06,20.51 40.16,21.41 40.16,24.94 38.05,27.05 31.42,27.05 J1.16
SPI_COPI1/SDIO_CMD
  Top 0.203: U5.18 39.59,19.31 38.86,20.04 38.86,24.28 37.41,25.73 22.58,25.73 J1.20
SPI_SCK1/SDIO_CLK
  Top 0.203: U5.17 40.19,19.71 39.29,20.6 39.29,24.51 37.64,26.16 24.69,26.16 J1.19
SWDCK
  Top 0.203: U5.24 40.43,16.91 39.37,15.85 39.37,14.83 38.51,13.97 J11.3
SWDIO
  Top 0.203: U5.25 40.72,16.51 39.9,15.7 39.9,14.71 36.63,11.43 J11.4
USB_F_N
  Top 0.203: U5.46 52.33,16.51 R29.1
USB_F_P
  Top 0.203: U5.47 52.38,16.91 R28.1
USB_N
  Top 0.254: J10.A7 66.41,21.32 66.78,20.95 66.78,20.7 66.4,20.32 J10.B7 58.83,20.32 R29.2
USB_P
  Top 0.203: 64.36,21.16 64.03,20.83 64.75,20.83 64.39,21.18
  Top 0.254: J10.A6 64.36,20.82 | 64.36,20.82 58.51,20.82 55.12,17.42 R28.2 | J10.B6 64.62,21.82 64.36,21.57 64.36,21.16 64.36,20.82
V_USB  (via drill 0.3)
  Top 0.61: J10.VBUS1 v64.31,18.62 | v64.31,18.62 | J10.VBUS2 v64.31,23.52 63.36,23.52 63.36,23.53 C6.2 | v64.31,18.62 63.6,17.9 R23.1 62.45,17.75 IC2.4 64.51,14.24 CHG.+ 64.65,12 v64.64,11.99 | J2.1 65.99,2.14 D3.+ | Q3.1 61.21,8.78 v61.34,8.79
  Bottom 0.61: v64.31,18.62 v64.31,23.52 | v64.64,11.99 63.78,11.12 63.78,9.6 63.78,9.45 | 63.78,9.45 63.78,8.81 | 63.78,8.2 63.78,4.2 J2.1 | v61.34,8.79 63.12,8.79 | 63.12,8.79 63.2,8.79 | 63.2,8.79 63.75,8.79 63.78,8.81 | 63.2,8.79 63.78,8.2 | 63.78,8.2 63.78,8.81 | 63.78,9.45 63.12,8.79
VBAT
  Top 0.61: BAT.1 62.97,7.47 Q3.3 62.61,10.09 D1.+ 62.41,12.04 R13.2 62.45,12.07 IC2.3
VSYS
  Top 0.61: J2.2 63.45,2.28 D3.- 60.42,6.79 Q3.2 59.36,8.03 59.36,10.94 | 59.36,10.94 58.76,11.54 U8.1 58.25,13.01 R5.1 C2.2 | 59.36,10.94 D1.-

### Text on the board
tPlace: - | +
bPlace: GP15 | GP14 | GND | GP13 | GP12 | GP11 | GP10 | GND | GP9 | GP8 | GP7 | GP6 | GND | GP5 | GP4 | GP3 | GP2 | GND | GP1 | GP0 | 3V3 | GND | MaPIE RP2040 | DCK | 0.96" OLED V1.1 | DIO | www.makerfabs.com | - | + | GP21 | GND | GP22 | RUN | GP26 | GP27 | GND | GP28 | ADC_VREF | 3V3(OUT) | 3V3_EN | GND | VSYS | VBUS | GP16 | GP17 | GND | GP18 | GP19 | GP20